# Altium project RK_NVR_DEMO1_RK3588_LP4XD200P232SD8_V21_20211228.PrjPcb (part 7 of 19)

## Sheet 22.Power_Ext Discrete_RTC IC.SchDoc
size 420 x 297 mm; Revision: V2.1; Schematic Page Number: 11; Page Number: 22; Check: Default; Schematic Name: RK_NVR_DEMO1_RK3588_LP4/4x_V21; Page Count: 43; Page name: 22.Power_Ext Discrete/RTC IC; Designer: Zhangdz; Schematic Page Count: 99; Revcode: V2.1; DsnPath: E:\Work\SBER\RK3588_SOM\temp\RK_NVR_DEMO1_RK3588_LP4XD200P232SD8_V21_20211228.DSN; SchematicName: RK_NVR_DEMO1_RK3588_LP4/4x_V21; PageName: 22.Power_Ext Discrete/RTC IC; PageSize: A3; TopSchematic: True
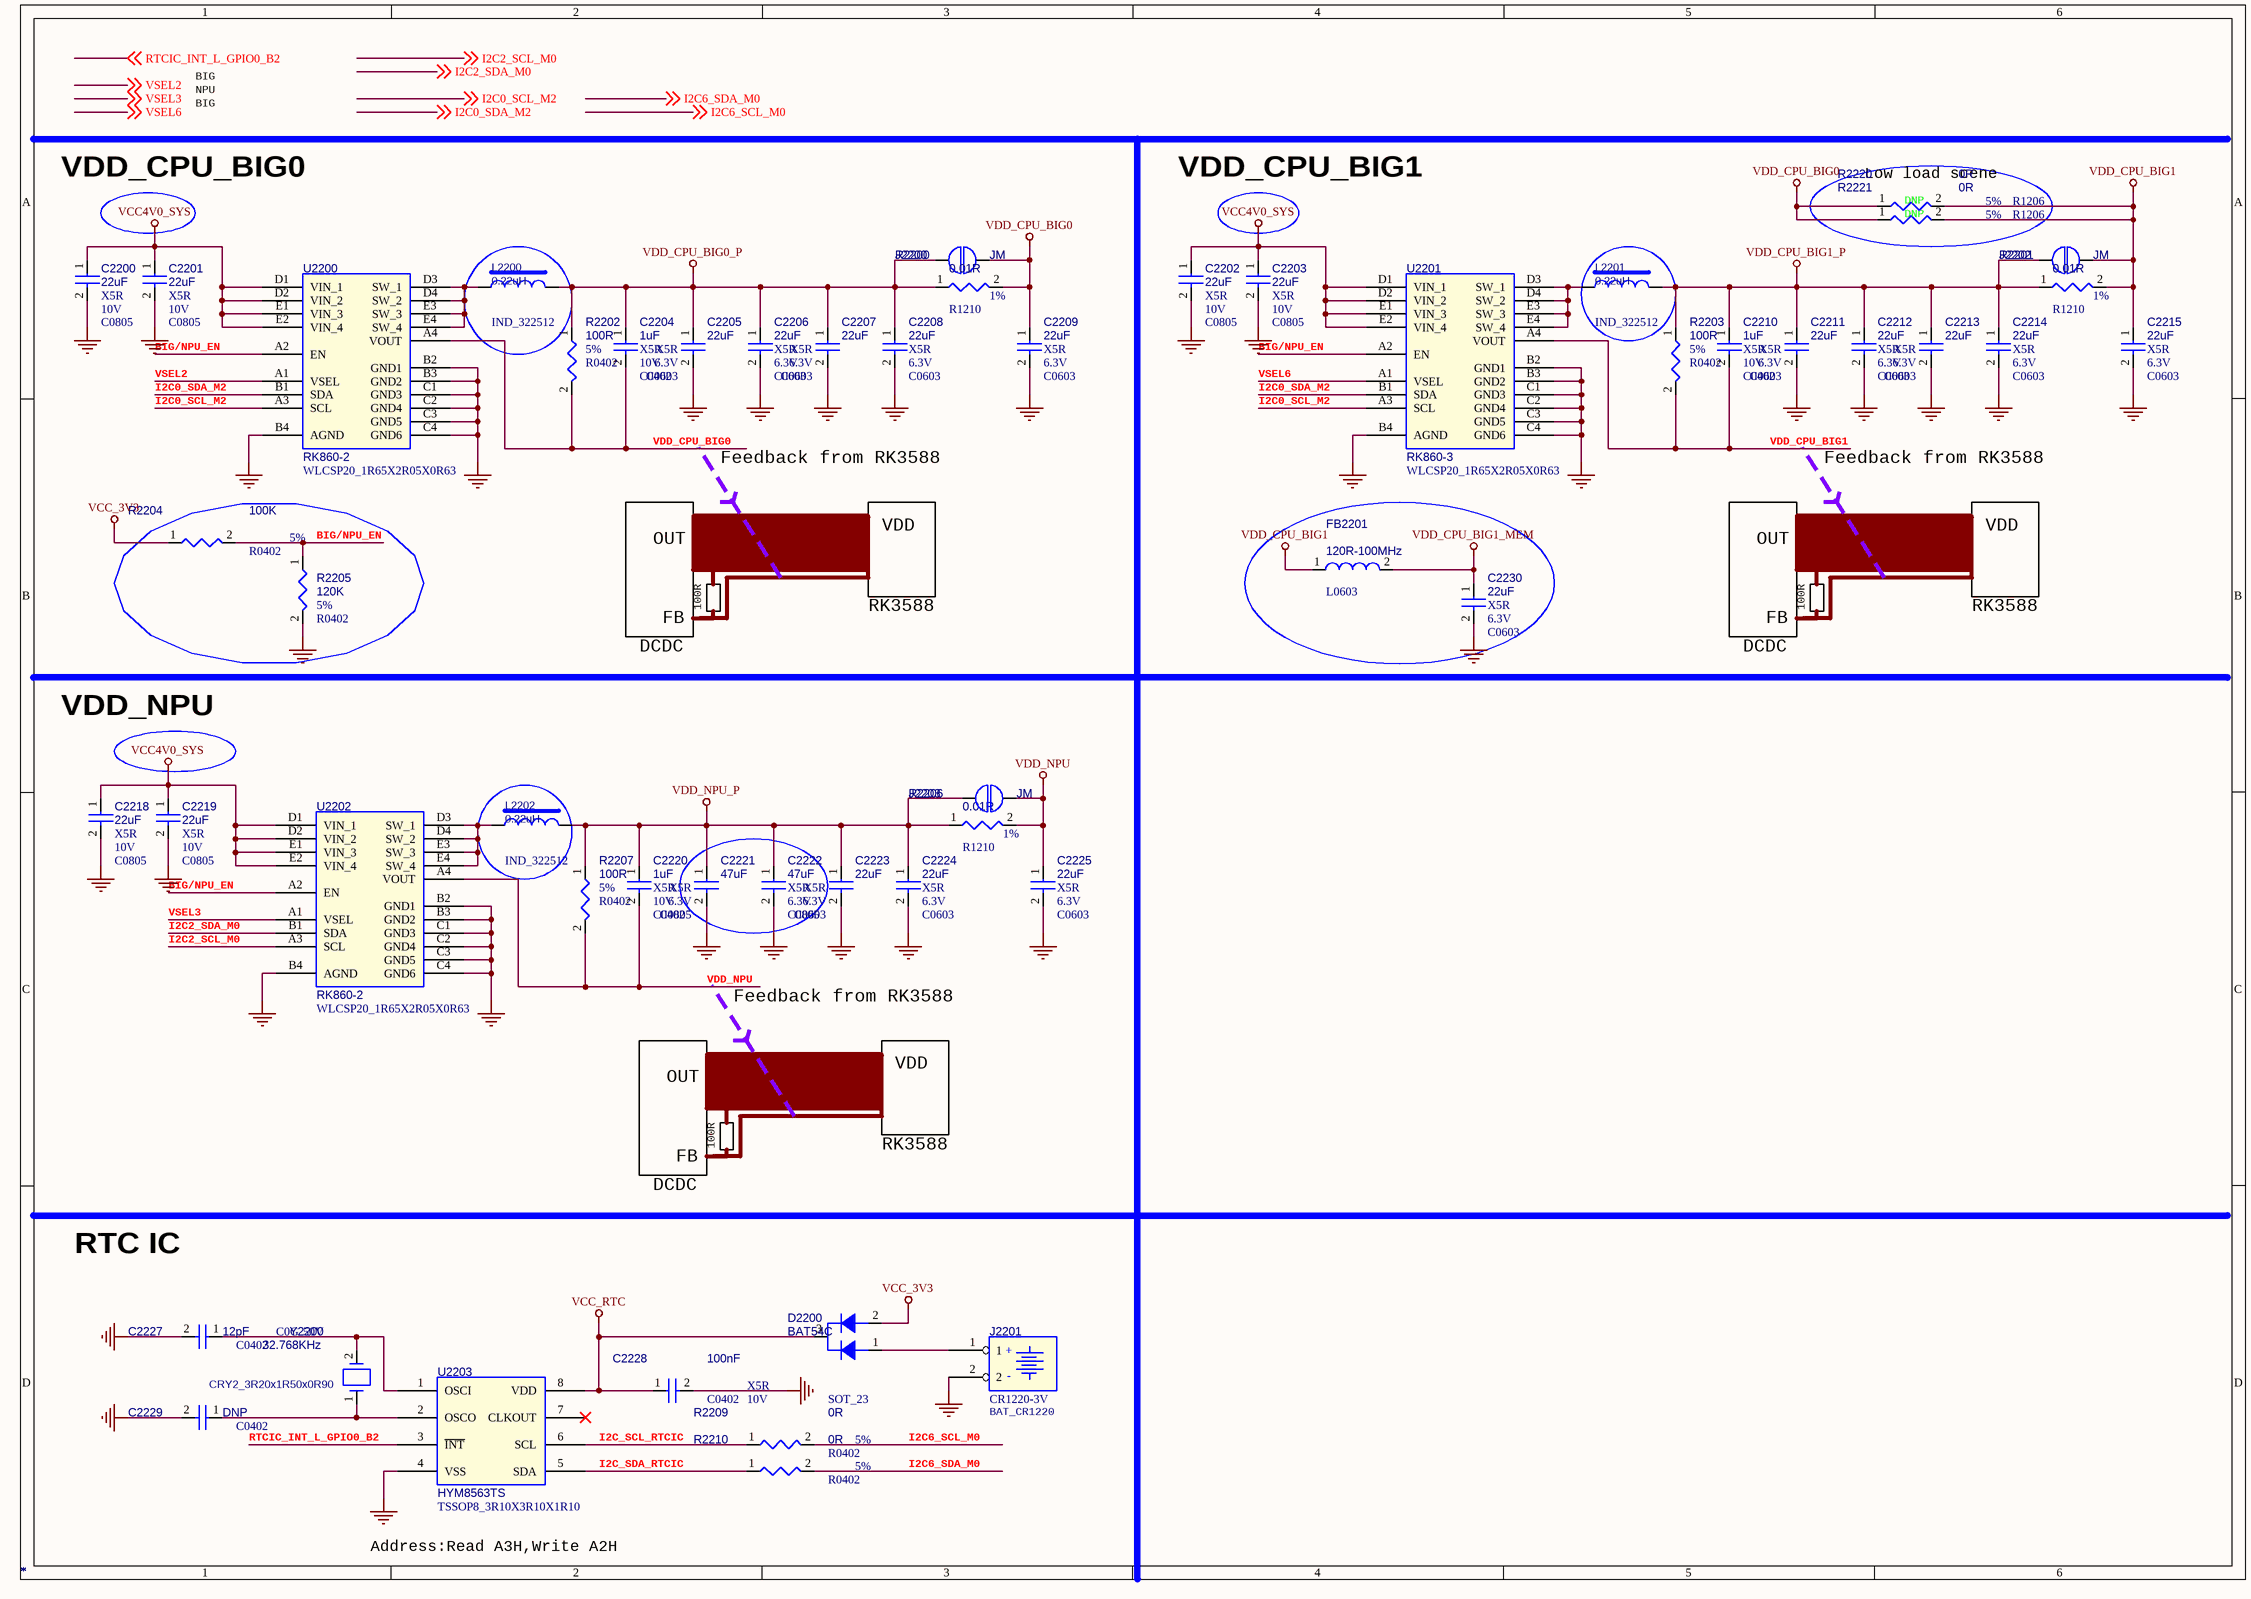
[diagram p43: 22.Power_Ext Discrete_RTC IC.SchDoc]

### Parts
C2200  *  Voltage: 10V  Dielectric: X5R  [C0805]
C2201  *  Voltage: 10V  Dielectric: X5R  [C0805]
C2202  *  Voltage: 10V  Dielectric: X5R  [C0805]
C2203  *  Voltage: 10V  Dielectric: X5R  [C0805]
C2204  *  Voltage: 10V  Dielectric: X5R  [C0402]
C2205  *  Voltage: 6.3V  Dielectric: X5R  [C0603]
C2206  *  Voltage: 6.3V  Dielectric: X5R  [C0603]
C2207  *  Voltage: 6.3V  Dielectric: X5R  [C0603]
C2208  *  Voltage: 6.3V  Dielectric: X5R  [C0603]
C2209  *  Voltage: 6.3V  Dielectric: X5R  [C0603]
C2210  *  Voltage: 10V  Dielectric: X5R  [C0402]
C2211  *  Voltage: 6.3V  Dielectric: X5R  [C0603]
C2212  *  Voltage: 6.3V  Dielectric: X5R  [C0603]
C2213  *  Voltage: 6.3V  Dielectric: X5R  [C0603]
C2214  *  Voltage: 6.3V  Dielectric: X5R  [C0603]
C2215  *  Voltage: 6.3V  Dielectric: X5R  [C0603]
C2218  *  Voltage: 10V  Dielectric: X5R  [C0805]
C2219  *  Voltage: 10V  Dielectric: X5R  [C0805]
C2220  *  Voltage: 10V  Dielectric: X5R  [C0402]
C2221  *  Voltage: 6.3V  Dielectric: X5R  [C0805]
C2222  *  Voltage: 6.3V  Dielectric: X5R  [C0805]
C2223  *  Voltage: 6.3V  Dielectric: X5R  [C0603]
C2224  *  Voltage: 6.3V  Dielectric: X5R  [C0603]
C2225  *  Voltage: 6.3V  Dielectric: X5R  [C0603]
C2227  *  Voltage: 50V  Dielectric: C0G  [C0402]
C2228  *  Voltage: 10V  Dielectric: X5R  [C0402]
C2229  *  [C0402]
C2230  *  Voltage: 6.3V  Dielectric: X5R  [C0603]
D2200  *  [SOT_23]
FB2201  *  [L0603]
J2200  *  [OPEN]
J2201  *  PCB Footprint: BAT_CR1220  [BATTERY-20MM]
J2202  *  [OPEN]
J2203  *  [OPEN]
L2200  *  [IND_322512]
L2201  *  [IND_322512]
L2202  *  [IND_322512]
R2200  *  PCB Footprint: R1210  Tolerance: 1%  [R0402]
R2201  *  PCB Footprint: R1210  Tolerance: 1%  [R0402]
R2202  *  Tolerance: 5%  [R0402]
R2203  *  Tolerance: 5%  [R0402]
R2204  *  Tolerance: 5%  [R0402]
R2205  *  Tolerance: 5%  [R0402]
R2206  *  PCB Footprint: R1210  Tolerance: 1%  [R0402]
R2207  *  Tolerance: 5%  [R0402]
R2209  *  Tolerance: 5%  [R0402]
R2210  *  Tolerance: 5%  [R0402]
R2220  *  PCB Footprint: R1206  Tolerance: 5%  Option: DNP  [R0402]
R2221  *  PCB Footprint: R1206  Tolerance: 5%  Option: DNP  [R0402]
U2200  *  PCB Footprint: WLCSP20_1R65X2R05X0R63  [WLCSP-20]
U2201  *  PCB Footprint: WLCSP20_1R65X2R05X0R63  [WLCSP-20]
U2202  *  PCB Footprint: WLCSP20_1R65X2R05X0R63  [WLCSP-20]
U2203  *  [TSSOP8_3R10X3R10X1R10]
Y2200  *  [CRY2_3R20x1R50x0R90]

### Nets
GND: C2200.2 C2201.2 C2202.2 C2203.2 C2205.2 C2206.2 C2207.2 C2208.2 C2209.2 C2211.2 C2212.2 C2213.2 C2214.2 C2215.2 C2218.2 C2219.2 C2221.2 C2222.2 C2223.2 C2224.2 C2225.2 C2227.2 C2228.2 C2229.2 C2230.2 J2201.2 R2205.2 U2200.B2(GND1) U2200.B3(GND2) U2200.B4(AGND) U2200.C1(GND3) U2200.C2(GND4) U2200.C3(GND5) U2200.C4(GND6) U2201.B2(GND1) U2201.B3(GND2) U2201.B4(AGND) U2201.C1(GND3) U2201.C2(GND4) U2201.C3(GND5) U2201.C4(GND6) U2202.B2(GND1) U2202.B3(GND2) U2202.B4(AGND) U2202.C1(GND3) U2202.C2(GND4) U2202.C3(GND5) U2202.C4(GND6) U2203.4(VSS)
VCC4V0_SYS: C2200.1 C2201.1 C2202.1 C2203.1 C2218.1 C2219.1 U2200.D1(VIN_1) U2200.D2(VIN_2) U2200.E1(VIN_3) U2200.E2(VIN_4) U2201.D1(VIN_1) U2201.D2(VIN_2) U2201.E1(VIN_3) U2201.E2(VIN_4) U2202.D1(VIN_1) U2202.D2(VIN_2) U2202.E1(VIN_3) U2202.E2(VIN_4)
VCC_3V3: D2200.2(A2) R2204.1
VCC_RTC: C2228.1 D2200.3(K) U2203.8(VDD)
VDD_CPU_BIG0: C2204.2 C2209.1 J2200.2 R2200.2 R2202.2 R2220.1 R2221.1 U2200.A4(VOUT)
VDD_CPU_BIG0_P: C2204.1 C2205.1 C2206.1 C2207.1 C2208.1 J2200.1 L2200.2 R2200.1 R2202.1
VDD_CPU_BIG1: C2210.2 C2215.1 FB2201.1 J2202.2 R2201.2 R2203.2 R2220.2 R2221.2 U2201.A4(VOUT)
VDD_CPU_BIG1_MEM: C2230.1 FB2201.2
VDD_CPU_BIG1_P: C2210.1 C2211.1 C2212.1 C2213.1 C2214.1 J2202.1 L2201.2 R2201.1 R2203.1
VDD_NPU: C2220.2 C2225.1 J2203.2 R2206.2 R2207.2 U2202.A4(VOUT)
VDD_NPU_P: C2220.1 C2221.1 C2222.1 C2223.1 C2224.1 J2203.1 L2202.2 R2206.1 R2207.1
BIG/NPU_EN: R2204.2 R2205.1 U2200.A2(EN) U2201.A2(EN) U2202.A2(EN)
I2C0_SCL_M2: U2200.A3(SCL) U2201.A3(SCL) ; off-sheet I2C0_SCL_M2
I2C0_SDA_M2: U2200.B1(SDA) U2201.B1(SDA) ; off-sheet I2C0_SDA_M2
I2C2_SCL_M0: U2202.A3(SCL) ; off-sheet I2C2_SCL_M0
I2C2_SDA_M0: U2202.B1(SDA) ; off-sheet I2C2_SDA_M0
I2C6_SCL_M0: R2209.2 ; off-sheet I2C6_SCL_M0
I2C6_SDA_M0: R2210.2 ; off-sheet I2C6_SDA_M0
I2C_SCL_RTCIC: R2209.1 U2203.6(SCL)
I2C_SDA_RTCIC: R2210.1 U2203.5(SDA)
RTCIC_INT_L_GPIO0_B2: U2203.3(~{INT}) ; off-sheet RTCIC_INT_L_GPIO0_B2
VSEL2: U2200.A1(VSEL) ; off-sheet VSEL2
VSEL3: U2202.A1(VSEL) ; off-sheet VSEL3
VSEL6: U2201.A1(VSEL) ; off-sheet VSEL6
NetC2227_1: C2227.1 U2203.1(OSCI) Y2200.2
NetC2229_1: C2229.1 U2203.2(OSCO) Y2200.1
NetD2200_1: D2200.1(A1) J2201.1
NetL2200_1: L2200.1 U2200.D3(SW_1) U2200.D4(SW_2) U2200.E3(SW_3) U2200.E4(SW_4)
NetL2201_1: L2201.1 U2201.D3(SW_1) U2201.D4(SW_2) U2201.E3(SW_3) U2201.E4(SW_4)
NetL2202_1: L2202.1 U2202.D3(SW_1) U2202.D4(SW_2) U2202.E3(SW_3) U2202.E4(SW_4)

Not connected (* = marked no-connect by the designer): U2203 7(CLKOUT)*

### Notes on the sheet
- NPU
- BIG
- VDD_CPU_BIG0
- VDD_CPU_BIG1
- Low load scene
- Feedback from RK3588
- VDD
- OUT
- DCDC
- FB
- 100R
- RK3588
- VDD_NPU
- RTC IC
- Address:Read A3H,Write A2H
- (in symbol CON_BATTERY-20MM) +; -

### Library data of the parts
C2200 = CAP NP: cap,22.00uF,+/-10%,10V,X5R,C0805; Part Reference: C2200; Manufacturer PN: C2012X5R1A226K125AB; Manufacturer: TDK; Value: 22uF; Tolerance: 10%; Priority: A; PCB Footprint: C0805; Created by: JJJ; Part Type: C0805; RK PN: C2012X5R1A226K125AB
C2201 = CAP NP: cap,22.00uF,+/-10%,10V,X5R,C0805; Part Reference: C2201; Manufacturer PN: C2012X5R1A226K125AB; Manufacturer: TDK; Value: 22uF; Tolerance: 10%; Priority: A; PCB Footprint: C0805; Created by: JJJ; Part Type: C0805; RK PN: C2012X5R1A226K125AB
C2202 = CAP NP: cap,22.00uF,+/-10%,10V,X5R,C0805; Part Reference: C2202; Manufacturer PN: C2012X5R1A226K125AB; Manufacturer: TDK; Value: 22uF; Tolerance: 10%; Priority: A; PCB Footprint: C0805; Created by: JJJ; Part Type: C0805; RK PN: C2012X5R1A226K125AB
C2203 = CAP NP: cap,22.00uF,+/-10%,10V,X5R,C0805; Part Reference: C2203; Manufacturer PN: C2012X5R1A226K125AB; Manufacturer: TDK; Value: 22uF; Tolerance: 10%; Priority: A; PCB Footprint: C0805; Created by: JJJ; Part Type: C0805; RK PN: C2012X5R1A226K125AB
C2204 = CAP NP: cap,1.00uF,+/-10%,10V,X5R,C0402; Part Reference: C2204; Manufacturer: TDK; Value: 1uF; RK PN: C1005X5R1A105K050BB; Priority: A; Tolerance: 10%; PCB Footprint: C0402; Part Type: C0402; Manufacturer PN: C1005X5R1A105K050BB; Created by: JJJ
C2205 = CAP NP: cap,22.00uF,+/-20%,6.3V,X5R,C0603; Part Reference: C2205; Manufacturer: TDK; Value: 22uF; RK PN: C1608X5R0J226M080AC; Priority: A; Tolerance: 20%; PCB Footprint: C0603; Part Type: C0603; C_Voltage: 6.3V; Manufacturer PN: C1608X5R0J226M080AC; Created by: JJJ
C2206 = CAP NP: cap,22.00uF,+/-20%,6.3V,X5R,C0603; Part Reference: C2206; Manufacturer PN: C1608X5R0J226M080AC; Manufacturer: TDK; Value: 22uF; Tolerance: 20%; Priority: A; Number: 37; PCB Footprint: C0603; Created by: JJJ; C_Voltage: 6.3V; Part Type: C0603; RK PN: C1608X5R0J226M080AC
C2207 = CAP NP: cap,22.00uF,+/-20%,6.3V,X5R,C0603; Part Reference: C2207; Manufacturer PN: C1608X5R0J226M080AC; Manufacturer: TDK; Value: 22uF; Tolerance: 20%; Priority: A; PCB Footprint: C0603; Created by: JJJ; C_Voltage: 6.3V; Part Type: C0603; RK PN: C1608X5R0J226M080AC
C2208 = CAP NP: cap,22.00uF,+/-20%,6.3V,X5R,C0603; Part Reference: C2208; Manufacturer PN: C1608X5R0J226M080AC; Manufacturer: TDK; Value: 22uF; Tolerance: 20%; Priority: A; PCB Footprint: C0603; Created by: JJJ; Part Type: C0603; RK PN: C1608X5R0J226M080AC
C2209 = CAP NP: cap,22.00uF,+/-20%,6.3V,X5R,C0603; Part Reference: C2209; Manufacturer: TDK; Value: 22uF; RK PN: C1608X5R0J226M080AC; Priority: A; Tolerance: 20%; PCB Footprint: C0603; Part Type: C0603; Manufacturer PN: C1608X5R0J226M080AC; Created by: JJJ
C2210 = CAP NP: cap,1.00uF,+/-10%,10V,X5R,C0402; Part Reference: C2210; Manufacturer: TDK; Value: 1uF; RK PN: C1005X5R1A105K050BB; Priority: A; Tolerance: 10%; PCB Footprint: C0402; Part Type: C0402; Manufacturer PN: C1005X5R1A105K050BB; Created by: JJJ
C2211 = CAP NP: cap,22.00uF,+/-20%,6.3V,X5R,C0603; Part Reference: C2211; Manufacturer: TDK; Value: 22uF; RK PN: C1608X5R0J226M080AC; Priority: A; Tolerance: 20%; PCB Footprint: C0603; Part Type: C0603; C_Voltage: 6.3V; Manufacturer PN: C1608X5R0J226M080AC; Created by: JJJ
C2212 = CAP NP: cap,22.00uF,+/-20%,6.3V,X5R,C0603; Part Reference: C2212; Manufacturer PN: C1608X5R0J226M080AC; Manufacturer: TDK; Value: 22uF; Tolerance: 20%; Priority: A; Number: 37; PCB Footprint: C0603; Created by: JJJ; C_Voltage: 6.3V; Part Type: C0603; RK PN: C1608X5R0J226M080AC
C2213 = CAP NP: cap,22.00uF,+/-20%,6.3V,X5R,C0603; Part Reference: C2213; Manufacturer PN: C1608X5R0J226M080AC; Manufacturer: TDK; Value: 22uF; Tolerance: 20%; Priority: A; PCB Footprint: C0603; Created by: JJJ; C_Voltage: 6.3V; Part Type: C0603; RK PN: C1608X5R0J226M080AC
C2214 = CAP NP: cap,22.00uF,+/-20%,6.3V,X5R,C0603; Part Reference: C2214; Manufacturer PN: C1608X5R0J226M080AC; Manufacturer: TDK; Value: 22uF; Tolerance: 20%; Priority: A; PCB Footprint: C0603; Created by: JJJ; Part Type: C0603; RK PN: C1608X5R0J226M080AC
C2215 = CAP NP: cap,22.00uF,+/-20%,6.3V,X5R,C0603; Part Reference: C2215; Manufacturer: TDK; Value: 22uF; RK PN: C1608X5R0J226M080AC; Priority: A; Tolerance: 20%; PCB Footprint: C0603; Part Type: C0603; Manufacturer PN: C1608X5R0J226M080AC; Created by: JJJ
C2218 = CAP NP: cap,22.00uF,+/-10%,10V,X5R,C0805; Part Reference: C2218; Manufacturer: TDK; Value: 22uF; RK PN: C2012X5R1A226K125AB; Priority: A; Tolerance: 10%; PCB Footprint: C0805; Part Type: C0805; Manufacturer PN: C2012X5R1A226K125AB; Created by: JJJ
C2219 = CAP NP: cap,22.00uF,+/-10%,10V,X5R,C0805; Part Reference: C2219; Manufacturer: TDK; Value: 22uF; RK PN: C2012X5R1A226K125AB; Priority: A; Tolerance: 10%; PCB Footprint: C0805; Part Type: C0805; Manufacturer PN: C2012X5R1A226K125AB; Created by: JJJ
C2220 = CAP NP: cap,1.00uF,+/-10%,10V,X5R,C0402; Part Reference: C2220; Manufacturer PN: C1005X5R1A105K050BB; Manufacturer: TDK; Value: 1uF; Tolerance: 10%; Priority: A; PCB Footprint: C0402; Created by: JJJ; Part Type: C0402; RK PN: C1005X5R1A105K050BB
C2221 = CAP NP: cap,47.00uF,+/-20%,6.3V,X5R,C0805; Part Reference: C2221; Manufacturer PN: C2012X5R0J476M125AC; Manufacturer: TDK; Value: 47uF; Tolerance: 20%; Priority: A; PCB Footprint: C0805; Created by: JJJ; C_Voltage: 6.3V; Part Type: C0805; RK PN: C2012X5R0J476M125AC
C2222 = CAP NP: cap,47.00uF,+/-20%,6.3V,X5R,C0805; Part Reference: C2222; Manufacturer: TDK; Value: 47uF; Number: 37; RK PN: C2012X5R0J476M125AC; Priority: A; Tolerance: 20%; PCB Footprint: C0805; Part Type: C0805; Manufacturer PN: C2012X5R0J476M125AC; C_Voltage: 6.3V; Created by: JJJ
C2223 = CAP NP: cap,22.00uF,+/-20%,6.3V,X5R,C0603; Part Reference: C2223; Manufacturer: TDK; Value: 22uF; RK PN: C1608X5R0J226M080AC; Priority: A; Tolerance: 20%; PCB Footprint: C0603; Part Type: C0603; C_Voltage: 6.3V; Manufacturer PN: C1608X5R0J226M080AC; Created by: JJJ
C2224 = CAP NP: cap,22.00uF,+/-20%,6.3V,X5R,C0603; Part Reference: C2224; Manufacturer: TDK; Value: 22uF; RK PN: C1608X5R0J226M080AC; Priority: A; Tolerance: 20%; PCB Footprint: C0603; Part Type: C0603; Manufacturer PN: C1608X5R0J226M080AC; Created by: JJJ
C2225 = CAP NP: cap,22.00uF,+/-20%,6.3V,X5R,C0603; Part Reference: C2225; Manufacturer: TDK; Value: 22uF; RK PN: C1608X5R0J226M080AC; Priority: A; Tolerance: 20%; PCB Footprint: C0603; Part Type: C0603; Manufacturer PN: C1608X5R0J226M080AC; Created by: JJJ
C2227 = CAP NP: cap,12.00pF,+/-5%,50V,C0G,C0402; Part Reference: C2227; Manufacturer: TDK; Value: 12pF; RK PN: C1005C0G1H120J050BA; Priority: A; Tolerance: 5%; PCB Footprint: C0402; Part Type: C0402; Manufacturer PN: C1005C0G1H120J050BA; Created by: JJJ
C2228 = CAP NP: cap,100.00nF,+/-10%,10V,X5R,C0402; Part Reference: C2228; Manufacturer: TDK; Value: 100nF; Number: 37; RK PN: C1005X5R1A104K050BA; Priority: A; Tolerance: 10%; C_Voltage: 6.3V; PCB Footprint: C0402; Part Type: C0402; Manufacturer PN: C1005X5R1A104K050BA; Created by: JJJ
C2229 = CAP NP: Did Not Place.; Part Reference: C2229; Value: DNP; RK PN: DNPC0402; Priority: A; PCB Footprint: C0402; Part Type: DNP; Manufacturer PN: DNPC0402; Created by: JJJ
C2230 = CAP NP: cap,22.00uF,+/-20%,6.3V,X5R,C0603; Part Reference: C2230; Manufacturer: TDK; Value: 22uF; RK PN: C1608X5R0J226M080AC; Priority: A; Tolerance: 20%; PCB Footprint: C0603; Part Type: C0603; Manufacturer PN: C1608X5R0J226M080AC; Created by: JJJ
D2200 = DIODE Double: Dual Schottky barrierЈ¬BAT54C SOT-23 Schottky Barrier; Part Reference: D2200; Manufacturer: і¤µз; Value: BAT54C; Priority: A; PCB Footprint: SOT_23; Created by: JJJ; Manufacturer PN: BAT54C; Part Type: Schottky rectifier; RK PN: BAT54C
FB2201 = BEAD: BEAD,120R@100MHz,current=2000mA,0603; Part Reference: FB2201; Manufacturer: Murata; DC Resistor: 0.030ohm; Tolerance: 25%; Irms: 2A; Value: 120R-100MHz; RK PN: BLM18KG121TN1; Priority: L; PCB Footprint: L0603; Part Type: BEAD; Manufacturer PN: BLM18KG121TN1; Created by: DZS
J2200 = JM_0: Part Reference: J2200; Value: JM; PCB Footprint: OPEN
J2201 = CON_BATTERY-20MM: Part Reference: J2201; Value: CR1220-3V
J2202 = JM_0: Part Reference: J2202; Value: JM; PCB Footprint: OPEN
J2203 = JM_0: Part Reference: J2203; Value: JM; PCB Footprint: OPEN
L2200 = INDUCTORS OF FERRITE_Dup1: Power Inductor,0.22uH,20%,IND_322512; Part Reference: L2200; Manufacturer: TDK; Isat: 10A; DC Resistor: 6ohm; RK PN: TMS322512ALM-R22MTAA; Priority: A; Tolerance: 0.2; Resonace frequency: 1MHz; PCB Footprint: IND_322512; Value: 0.22uH; Part Type: POWER_IND; Manufacturer PN: TMS322512ALM-R22MTAA; Created by: YWQ
L2201 = INDUCTORS OF FERRITE_Dup1: Power Inductor,0.22uH,20%,IND_322512; Part Reference: L2201; Manufacturer: TDK; Isat: 10A; DC Resistor: 6ohm; RK PN: TMS322512ALM-R22MTAA; Priority: A; Tolerance: 0.2; Resonace frequency: 1MHz; PCB Footprint: IND_322512; Value: 0.22uH; Part Type: POWER_IND; Manufacturer PN: TMS322512ALM-R22MTAA; Created by: YWQ
L2202 = INDUCTORS OF FERRITE_Dup1: Power Inductor,0.22uH,20%,IND_322512; Part Reference: L2202; Manufacturer PN: TMS322512ALM-R22MTAA; Manufacturer: TDK; Isat: 10A; DC Resistor: 6ohm; Resonace frequency: 1MHz; Tolerance: 0.2; Priority: A; PCB Footprint: IND_322512; Value: 0.22uH; Created by: YWQ; Part Type: POWER_IND; RK PN: TMS322512ALM-R22MTAA
R2200 = RESISTOR_Dup1: єсД¤µНЧиЦµµзЧи,0R01,+/-1%,R1210,1/2W.; Part Reference: R2200; Manufacturer PN: RL1210FR-070R01L; Manufacturer: YAGEO; Value: 0.01R; Wattage: 1/2W; Priority: A; Created by: YTL; Part Type: єсД¤µНЧиЦµµзЧи; RK PN: RL1210FR-070R01L
R2201 = RESISTOR_Dup1: єсД¤µНЧиЦµµзЧи,0R01,+/-1%,R1210,1/2W.; Part Reference: R2201; Manufacturer PN: RL1210FR-070R01L; Manufacturer: YAGEO; Value: 0.01R; Wattage: 1/2W; Priority: A; Created by: YTL; Part Type: єсД¤µНЧиЦµµзЧи; RK PN: RL1210FR-070R01L
R2202 = RESISTOR_Dup1: НЁУГєсД¤µзЧи,100R,+/-5%,R0402,1/16W.; Part Reference: R2202; Manufacturer PN: RC0402JR-07100RL; Manufacturer: YAGEO; Wattage: 1/16W; Priority: A; PCB Footprint: R0402; Value: 100R; Created by: YTL; Part Type: НЁУГєсД¤µзЧи; RK PN: RC0402JR-07100RL
R2203 = RESISTOR_Dup1: НЁУГєсД¤µзЧи,100R,+/-5%,R0402,1/16W.; Part Reference: R2203; Manufacturer PN: RC0402JR-07100RL; Manufacturer: YAGEO; Wattage: 1/16W; Priority: A; PCB Footprint: R0402; Value: 100R; Created by: YTL; Part Type: НЁУГєсД¤µзЧи; RK PN: RC0402JR-07100RL
R2204 = RESISTOR_Dup1: НЁУГєсД¤µзЧи,100K,+/-5%,R0402,1/16W.; Part Reference: R2204; Manufacturer PN: RC0402JR-07100KL; Manufacturer: YAGEO; Wattage: 1/16W; Priority: A; PCB Footprint: R0402; Value: 100K; Created by: YTL; Part Type: НЁУГєсД¤µзЧи; RK PN: RC0402JR-07100KL
R2205 = RESISTOR_Dup1: НЁУГєсД¤µзЧи,120K,+/-5%,R0402,1/16W.; Part Reference: R2205; Manufacturer PN: RC0402JR-07120KL; Manufacturer: YAGEO; Wattage: 1/16W; Priority: A; PCB Footprint: R0402; Value: 120K; Created by: YTL; Part Type: НЁУГєсД¤µзЧи; RK PN: RC0402JR-07120KL
R2206 = RESISTOR_Dup1: єсД¤µНЧиЦµµзЧи,0R01,+/-1%,R1210,1/2W.; Part Reference: R2206; Manufacturer PN: RL1210FR-070R01L; Manufacturer: YAGEO; Value: 0.01R; Wattage: 1/2W; Priority: A; Created by: YTL; Part Type: єсД¤µНЧиЦµµзЧи; RK PN: RL1210FR-070R01L
R2207 = RESISTOR_Dup1: НЁУГєсД¤µзЧи,100R,+/-5%,R0402,1/16W.; Part Reference: R2207; Manufacturer: YAGEO; RK PN: RC0402JR-07100RL; Priority: A; Wattage: 1/16W; PCB Footprint: R0402; Value: 100R; Part Type: НЁУГєсД¤µзЧи; Manufacturer PN: RC0402JR-07100RL; Created by: YTL
R2209 = RESISTOR_Dup1: НЁУГєсД¤µзЧи,0R,+/-5%,R0402,1/16W.; Part Reference: R2209; Manufacturer: YAGEO; RK PN: RC0402JR-070RL; Priority: A; Wattage: 1/16W; PCB Footprint: R0402; Value: 0R; Part Type: НЁУГєсД¤µзЧи; Manufacturer PN: RC0402JR-070RL; Created by: YTL
R2210 = RESISTOR_Dup1: НЁУГєсД¤µзЧи,0R,+/-5%,R0402,1/16W.; Part Reference: R2210; Manufacturer: YAGEO; RK PN: RC0402JR-070RL; Priority: A; Wattage: 1/16W; PCB Footprint: R0402; Value: 0R; Part Type: НЁУГєсД¤µзЧи; Manufacturer PN: RC0402JR-070RL; Created by: YTL
R2220 = RESISTOR_Dup1: НЁУГєсД¤µзЧи,0R,+/-5%,R1206,1/4W.; Part Reference: R2220; Manufacturer PN: RC1206JR-070RL; Manufacturer: YAGEO; Wattage: 1/4W; Priority: A; Value: 0R; Created by: YTL; Part Type: НЁУГєсД¤µзЧи; RK PN: RC1206JR-070RL
R2221 = RESISTOR_Dup1: НЁУГєсД¤µзЧи,0R,+/-5%,R1206,1/4W.; Part Reference: R2221; Manufacturer: YAGEO; RK PN: RC1206JR-070RL; Priority: A; Wattage: 1/4W; Value: 0R; Part Type: НЁУГєсД¤µзЧи; Manufacturer PN: RC1206JR-070RL; Created by: YTL
U2200 = DCDC_RK860: I2C-ADDR 42HЈ»Vout 0.5-1.5VЈ»Default Vout 0.8VЈ»Step 6.25mVЈ»Die_ID 0XA;; Part Reference: U2200; Manufacturer: Rockchip (ИрРѕОў); Value: RK860-2; Priority: A; Created by: YWQ; Manufacturer PN: RK860-2; Part Type: DCDC; RK PN: RK860-2
U2201 = DCDC_RK860: I2C-ADDR 43HЈ»Vout 0.5-1.5VЈ»Default Vout 0.8VЈ»Step 6.25mVЈ»Die_ID 0XA;; Part Reference: U2201; Manufacturer: Rockchip (ИрРѕОў); Value: RK860-3; Priority: A; Created by: YWQ; Manufacturer PN: RK860-3; Part Type: DCDC; RK PN: RK860-3
U2202 = DCDC_RK860: I2C-ADDR 42HЈ»Vout 0.5-1.5VЈ»Default Vout 0.8VЈ»Step 6.25mVЈ»Die_ID 0XA;; Part Reference: U2202; Manufacturer: Rockchip (ИрРѕОў); Value: RK860-2; Priority: A; RK PN: RK860-2; Part Type: DCDC; Manufacturer PN: RK860-2; Created by: YWQ
U2203 = RTC_HYM8563: I2C Real Time Clock/Calendar; Part Reference: U2203; Manufacturer: HaoyuЈЁк»кЕОўµзЧУЈ©; Value: HYM8563TS; Priority: A; PCB Footprint: TSSOP8_3R10X3R10X1R10; Created by: JJJ; Manufacturer PN: HYM8563TS; Part Type: RTC; RK PN: HYM8563TS
Y2200 = CRYSTAL_2P: ОЮФґѕ§ХсЈ¬32.768KHz,ЎА20ppmЈ¬12.5pF; Part Reference: Y2200; Manufacturer: TKD(М©ѕ§); RK PN: SF-3215; Priority: A; PCB Footprint: CRY2_3R20x1R50x0R90; Value: 32.768KHz; Part Type: CRYSTAL; Manufacturer PN: SF-3215; Created by: YWQ